# Altium schematic sheet MIDI.Schematic.SchDoc
size A
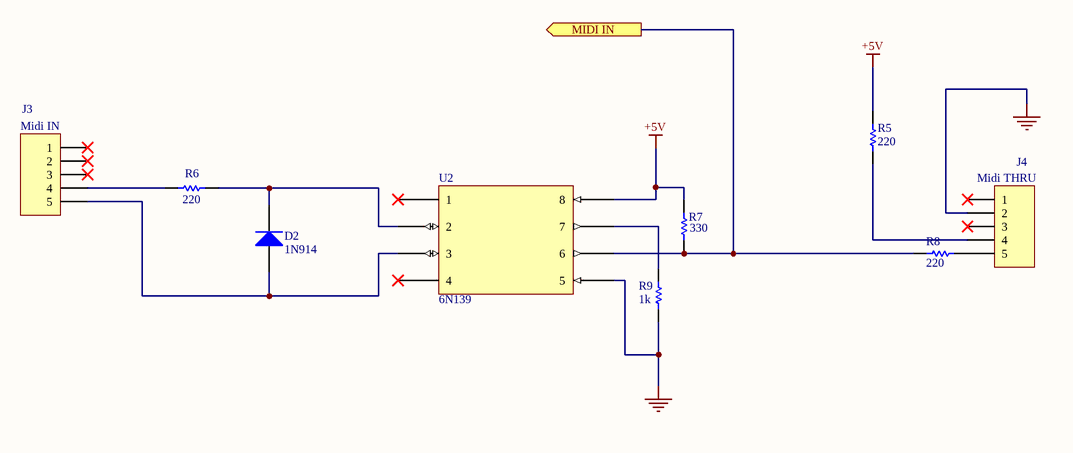
[diagram p0: MIDI.Schematic.SchDoc]

## Parts
D2  1N914  [1N914]
J3  Midi IN  [SOCKET MIDI]
J4  Midi THRU  [SOCKET MIDI]
R5  value 220  [CAPC1608N]  (hidden comment: Res1)
R6  value 220  [CAPC1608N]  (hidden comment: Res1)
R7  330  [CAPC1608N]
R8  value 220  [CAPC1608N]  (hidden comment: Res1)
R9  1k  [CAPC1608N]
U2  6N139  [6N139]

## Ports
MIDI IN (out)

## Nets
+5V: R5.2 R7.2 U2.8
GND: J4.2 R9.1 U2.5
MIDI IN: R7.1 R8.2 U2.6 ; port MIDI IN
NetD2_1: D2.1(A) J3.5 U2.3
NetD2_2: D2.2(K) R6.2 U2.2
NetJ3_4: J3.4 R6.1
NetJ4_4: J4.4 R5.1
NetJ4_5: J4.5 R8.1
NetR9_2: R9.2 U2.7

Not connected (* = marked no-connect by the designer): J3 1* 2* 3*; J4 1* 3*; U2 1* 4*

## Library data of the parts
D2 = Diode: Default Diode; Ref_Fabricant: 1N914BWT; Fabricant: Fairshild Semiconductor; Published: 8-Jun-2000; LatestRevisionDate: 17-Jul-2002; LatestRevisionNote: Re-released for DXP Platform.; PackageVersion: Sep-1996; PackageReference: SMC; Publisher: Altium Limited; PackageDescription: DO-214-AB/SMC; 2 C-Bend Leads; Body 7.9 x 5.9 mm, inc. leads (LxW); Code_JEDEC: DO-214-AB; Ref_Farnell: 2453752; Datasheet: http://www.farnell.com/datasheets/1781082.pdf
J3 J4 = Header 5: DIN 5 Pins; Ref_Fabricant: PSG03463; Fabricant: PRO SIGNAL; LatestRevisionDate: 17-Jul-2002; LatestRevisionNote: Re-released for DXP Platform.; Publisher: Altium Limited; Datasheet: http://www.farnell.com/datasheets/1697491.pdf; Ref_Farnell: 1791756
R5-R9 = Res1: Resistor; Published: 8-Jun-2000; LatestRevisionDate: 17-Jul-2002; LatestRevisionNote: Re-released for DXP Platform.; PackageReference: AXIAL-0.3; Publisher: Altium Limited; PackageDescription: Axial Device, Thru-Hole; 2 Leads; 0.3 in Pin Spacing
  R7: Value: 330
  R9: Value: 1K
U2 = Optocoupleur: Ref_Fabricant: 6N139-300E; Fabricant: Broadcom Limited; Datasheet: http://www.farnell.com/datasheets/1266261.pdf; Ref_Farnell: 1085023